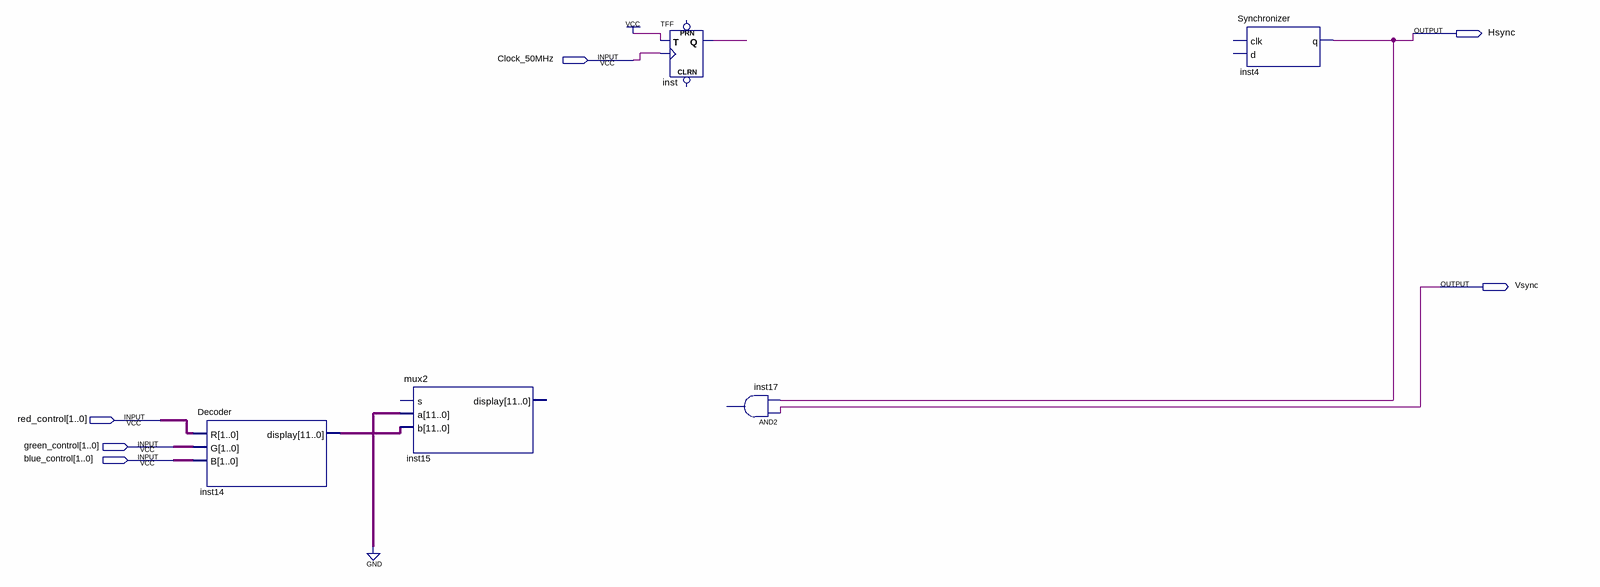
[diagram p0: schematic sheet]
// Quartus schematic Lab6.bdf as structural Verilog: 5 symbols, 6 pins
module Lab6 (
  input  Clock_50MHz,
  input  [1:0] red_control,
  input  [1:0] green_control,
  input  [1:0] blue_control,
  output Hsync,
  output Vsync
);

  wire inst_q;
  wire [11:0] inst14_display;

  Decoder inst14 (.R(red_control), .G(green_control), .B(blue_control), .display(inst14_display));
  mux2 inst15 (.a({12{1'b0}}), .b(inst14_display));  // open: s, display
  TFF inst (.T(1'b1), .CLK(Clock_50MHz), .Q(inst_q));  // open: PRN, CLRN
  // AND2 inst17 has open pins: IN1=Vsync, IN2=Hsync, OUT=open
  Synchronizer inst4 (.q(Hsync));  // open: clk, d
endmodule
